# EAGLE design amplifier (EAGLE 7.1.0)
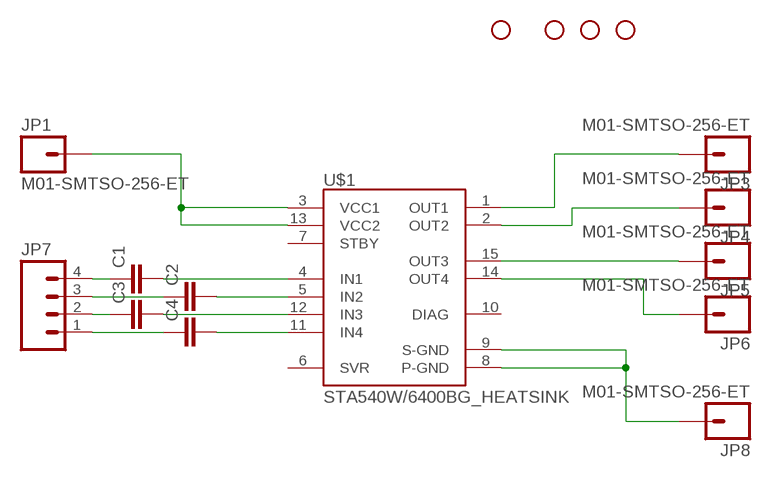
[diagram p0: schematic, sheet 1]

## Parts
C1  CAP1206  [1206]
C2  CAP1206  [1206]
C3  CAP1206  [1206]
C4  CAP1206  [1206]
JP1  M01-SMTSO-256-ET  [SMTSO-256-ET]
JP3  M01-SMTSO-256-ET  [SMTSO-256-ET]
JP4  M01-SMTSO-256-ET  [SMTSO-256-ET]
JP5  M01-SMTSO-256-ET  [SMTSO-256-ET]
JP6  M01-SMTSO-256-ET  [SMTSO-256-ET]
JP7  M04PTH  [1X04]
JP8  M01-SMTSO-256-ET  [SMTSO-256-ET]
STANDOFF1  STAND-OFF  [STAND-OFF]
STANDOFF2  STAND-OFF  [STAND-OFF]
STANDOFF3  STAND-OFF  [STAND-OFF]
STANDOFF4  STAND-OFF  [STAND-OFF]
U$1  STA540W/6400BG_HEATSINK  [MULTIWATT15_6400BGHEATSINK]

## Nets
N$1: JP3.P$1 U$1.1(OUT1)
N$2: JP4.P$1 U$1.2(OUT2)
N$3: JP5.P$1 U$1.15(OUT3)
N$4: JP6.P$1 U$1.14(OUT4)
N$5: JP8.P$1 U$1.8(P-GND) U$1.9(S-GND)
N$6: JP1.P$1 U$1.3(VCC1) U$1.13(VCC2)
N$7: C4.2 U$1.11(IN4)
N$8: C3.2 U$1.12(IN3)
N$9: C2.2 U$1.5(IN2)
N$10: C1.2 U$1.4(IN1)
N$11: C1.1 JP7.4
N$12: C2.1 JP7.3
N$13: C3.1 JP7.2
N$14: C4.1 JP7.1
Unconnected: U$1.6(SVR) U$1.7(STBY) U$1.10(DIAG)

## Library data of the parts
C1-C4 = 1_SparkFun-Capacitors:CAP: Capacitor Standard 0603 ceramic capacitor, and 0.1" leaded capacitor.
JP1 JP3-JP6 JP8 = 1_SparkFun-Connectors:M01: Header 1 Standard 1-pin 0.1" header. Use with straight break away headers (SKU : PRT-00116), right angle break away headers (PRT-00553), swiss pins (PRT-00743), machine pins (PRT-00117), and female headers (PRT-00115).
JP7 = 1_SparkFun-Connectors:M04: Header 4 Standard 4-pin 0.1" header. Use with straight break away headers (SKU : PRT-00116), right angle break away headers (PRT-00553), swiss pins (PRT-00743), machine pins (PRT-00117), and female headers (PRT-00115). Molex polarized connector foot print use with SKU : PRT-08231 with associated crimp pins and housings. 1MM SMD Version SKU: PRT-10208
STANDOFF1-STANDOFF4 = 1_SparkFun-Electromechanical:STAND-OFF: #4 Stand Off This is the mechanical footprint for a #4 phillips button head screw. Use the keepout ring to avoid running the screw head into surrounding components. SKU : PRT-00447
U$1 = 1_SparkFun-PowerIC:STA540: Multiwatt package for L298 bridge driver

## Board
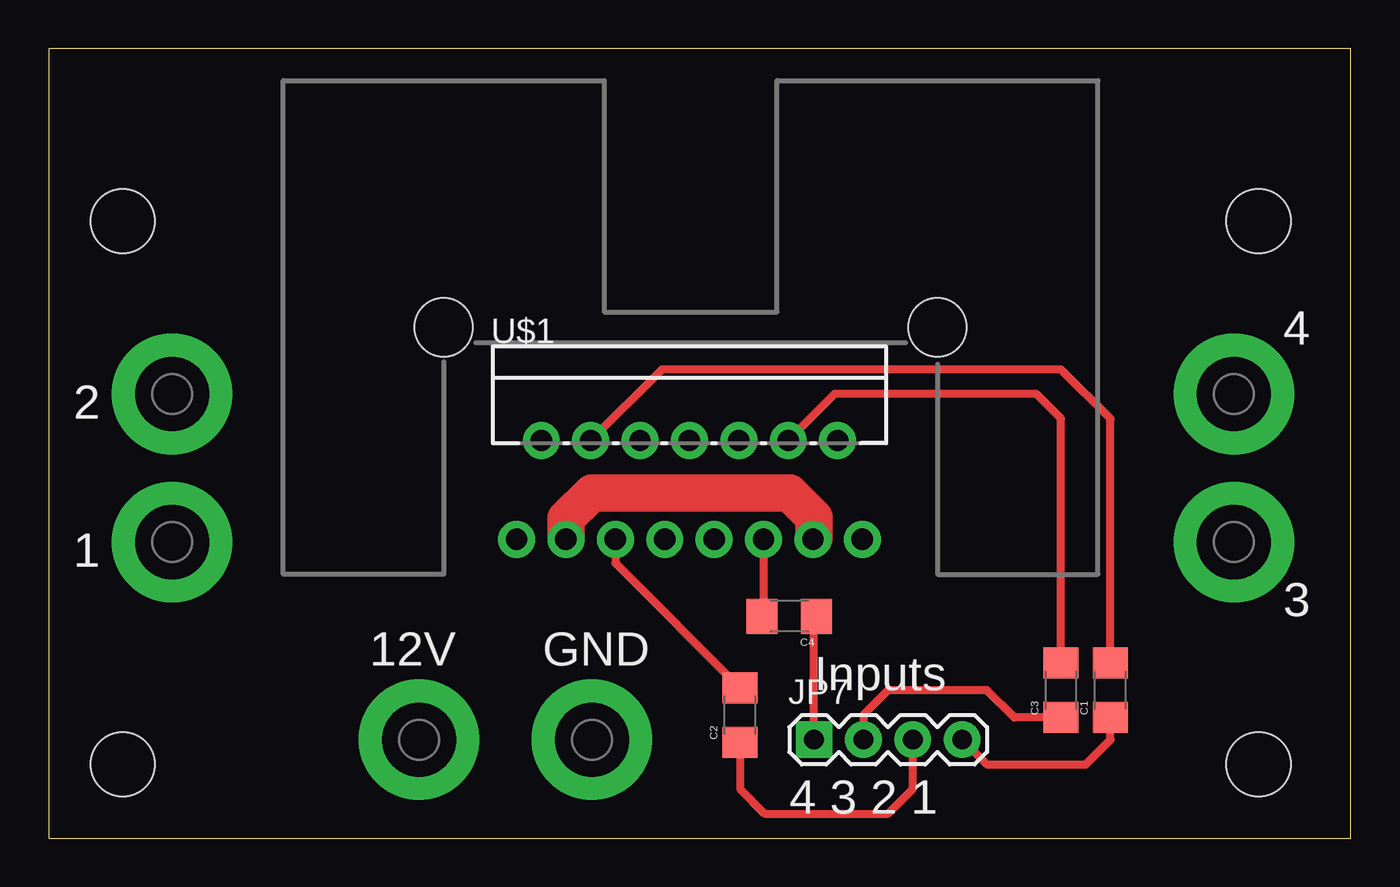
[diagram p1: board, top side]
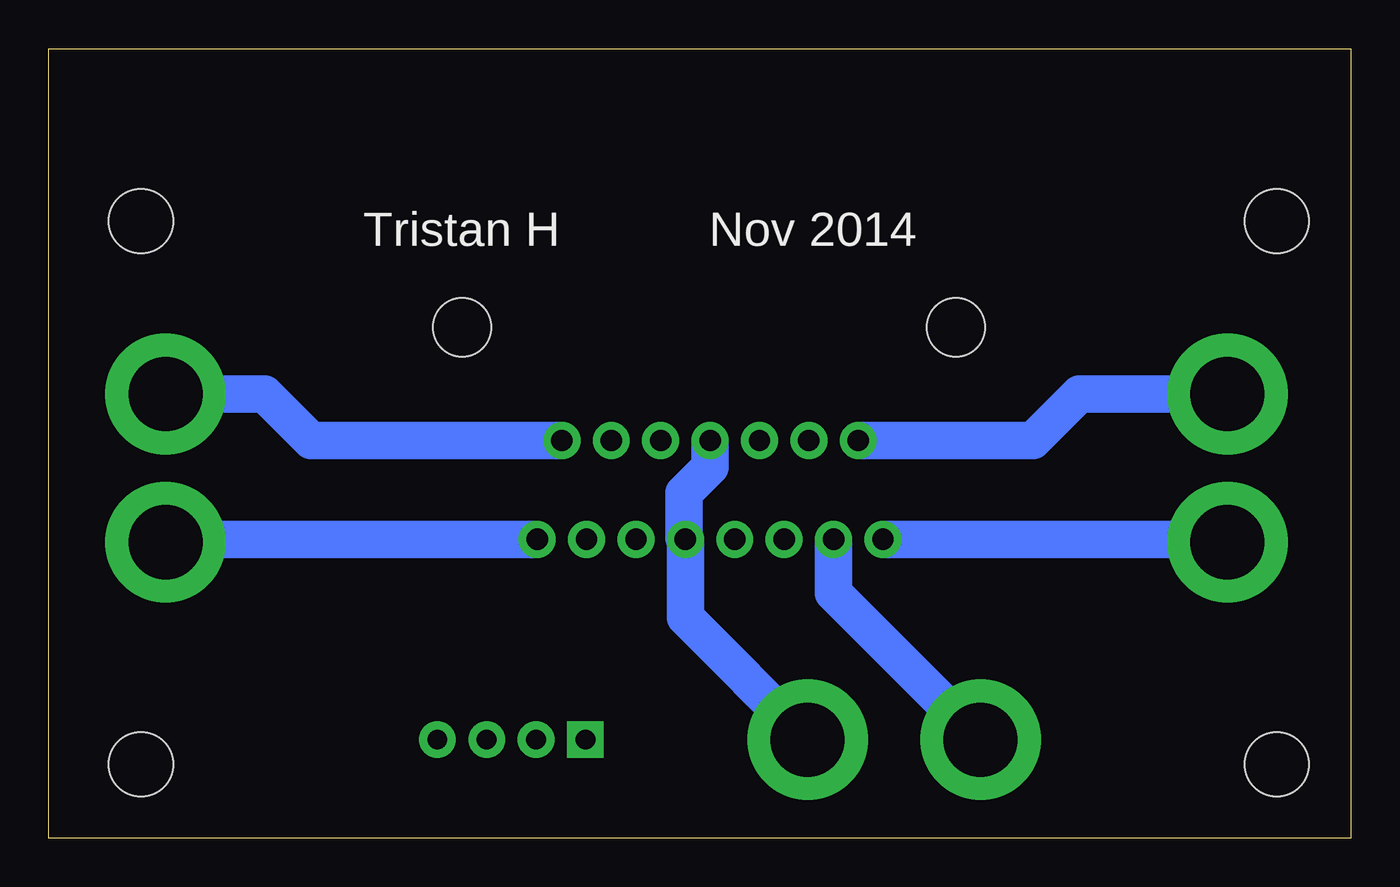
[diagram p2: board, bottom side, seen from below]

Size 66.98 x 40.63 mm. Coordinates in mm from the lower left corner, seen from the top.
Outline: 0,0 66.98,0 66.98,40.63 0,40.63 0,0
Copper layers (1*16): Top 0.035mm / dielectric 1.5mm / Bottom 0.035mm
Design rules "default": minimum track width 10mil, minimum drill 24mil, track to track 8mil, track to pad 8mil, pad to pad 8mil, via to via 8mil, smd to smd 8mil, copper to edge 40mil, drill to drill 8mil, minimum pad ring 10mil, minimum via ring 8mil, stop-mask expansion 4mil, vias tented up to drill 0mil, thermal gap 10mil

### Footprints (pad centres in the part's own frame; a part is rotated, then mirrored left to right if it is on the bottom)
1206 = smd 1.6 x 1.8: 1 -1.4,0; 2 1.4,0
SMTSO-256-ET = drill 3.81 pad 6.198: P$1 0,0
1X04 = drill 1.016 pad 1.88 square: 1 0,0 | drill 1.016 pad 1.88: 2 2.54,0; 3 5.08,0; 4 7.62,0
STAND-OFF = hole 3.302: 0,0
MULTIWATT15_6400BGHEATSINK = drill 1.1 pad 1.9: 1 -8.95,-2.39; 2 -7.68,2.69; 3 -6.41,-2.39; 4 -5.14,2.69; 5 -3.87,-2.39; 6 -2.6,2.69; 7 -1.33,-2.39; 8 -0.06,2.69; 9 1.21,-2.39; 10 2.48,2.69; 11 3.75,-2.39; 12 5.02,2.69; 13 6.29,-2.39; 14 7.56,2.69; 15 8.83,-2.39 | hole 2.997: -12.7,8.509; 12.7,8.509

### Placement (x,y rotation side)
C1  54.61,7.62 90 top
C2  35.56,6.35 90 top
C3  52.07,7.62 90 top
C4  38.1,11.43 180 top
JP1  19.05,5.08 0 top
JP3  6.35,15.24 0 top
JP4  6.35,22.86 0 top
JP5  60.96,15.24 0 top
JP6  60.96,22.86 0 top
JP7  39.37,5.08 0 top
JP8  27.94,5.08 0 top
STANDOFF1  3.81,3.81 0 top
STANDOFF2  3.81,31.75 0 top
STANDOFF3  62.23,31.75 0 top
STANDOFF4  62.23,3.81 0 top
U$1  33.02,17.78 0 top

### Tracks (layer width: path | path; a pad name or v marks a point on that pad's centre or on a via)
N$1
  Bottom 1.93: U$1.1 6.5,15.39 JP3.P$1
N$2
  Bottom 1.93: U$1.2 16.36,20.47 13.97,22.86 JP4.P$1
N$3
  Bottom 1.93: U$1.15 60.81,15.39 JP5.P$1
N$4
  Bottom 1.93: U$1.14 53.49,20.47 55.88,22.86 JP6.P$1
N$5
  Bottom 1.93: JP8.P$1 34.23,11.37 U$1.9 34.29,15.45 34.29,17.78 32.96,19.11 U$1.8
N$6
  Top 1.93: U$1.3 26.61,16.45 27.94,17.78 38.1,17.78 39.37,16.51 39.37,15.45 U$1.13
  Bottom 1.93: U$1.3 26.61,12.64 JP1.P$1
N$7
  Top 0.406: U$1.11 36.77,11.5 C4.2
N$8
  Top 0.406: C3.2 52.07,21.59 50.8,22.86 40.43,22.86 U$1.12
N$9
  Top 0.406: U$1.5 29.15,14.16 C2.2
N$10
  Top 0.406: C1.2 54.61,21.59 52.07,24.13 31.54,24.13 U$1.4
N$11
  Top 0.406: JP7.4 48.26,3.81 53.34,3.81 54.61,5.08 C1.1
N$12
  Top 0.406: C2.1 35.56,2.54 36.83,1.27 43.18,1.27 44.45,2.54 JP7.3
N$13
  Top 0.406: C3.1 49.66,6.22 48.26,7.62 43.18,7.62 41.91,6.35 JP7.2
N$14
  Top 0.406: JP7.1 39.37,11.3 C4.1

### Text on the board
tPlace: 4 | 2 | 1 | 3 | 12V | GND | Inputs | 4 3 2 1
bPlace: Nov 2014 | Tristan H